# EAGLE schematic psg-4ch-mux-simple (EAGLE 6.6.0)
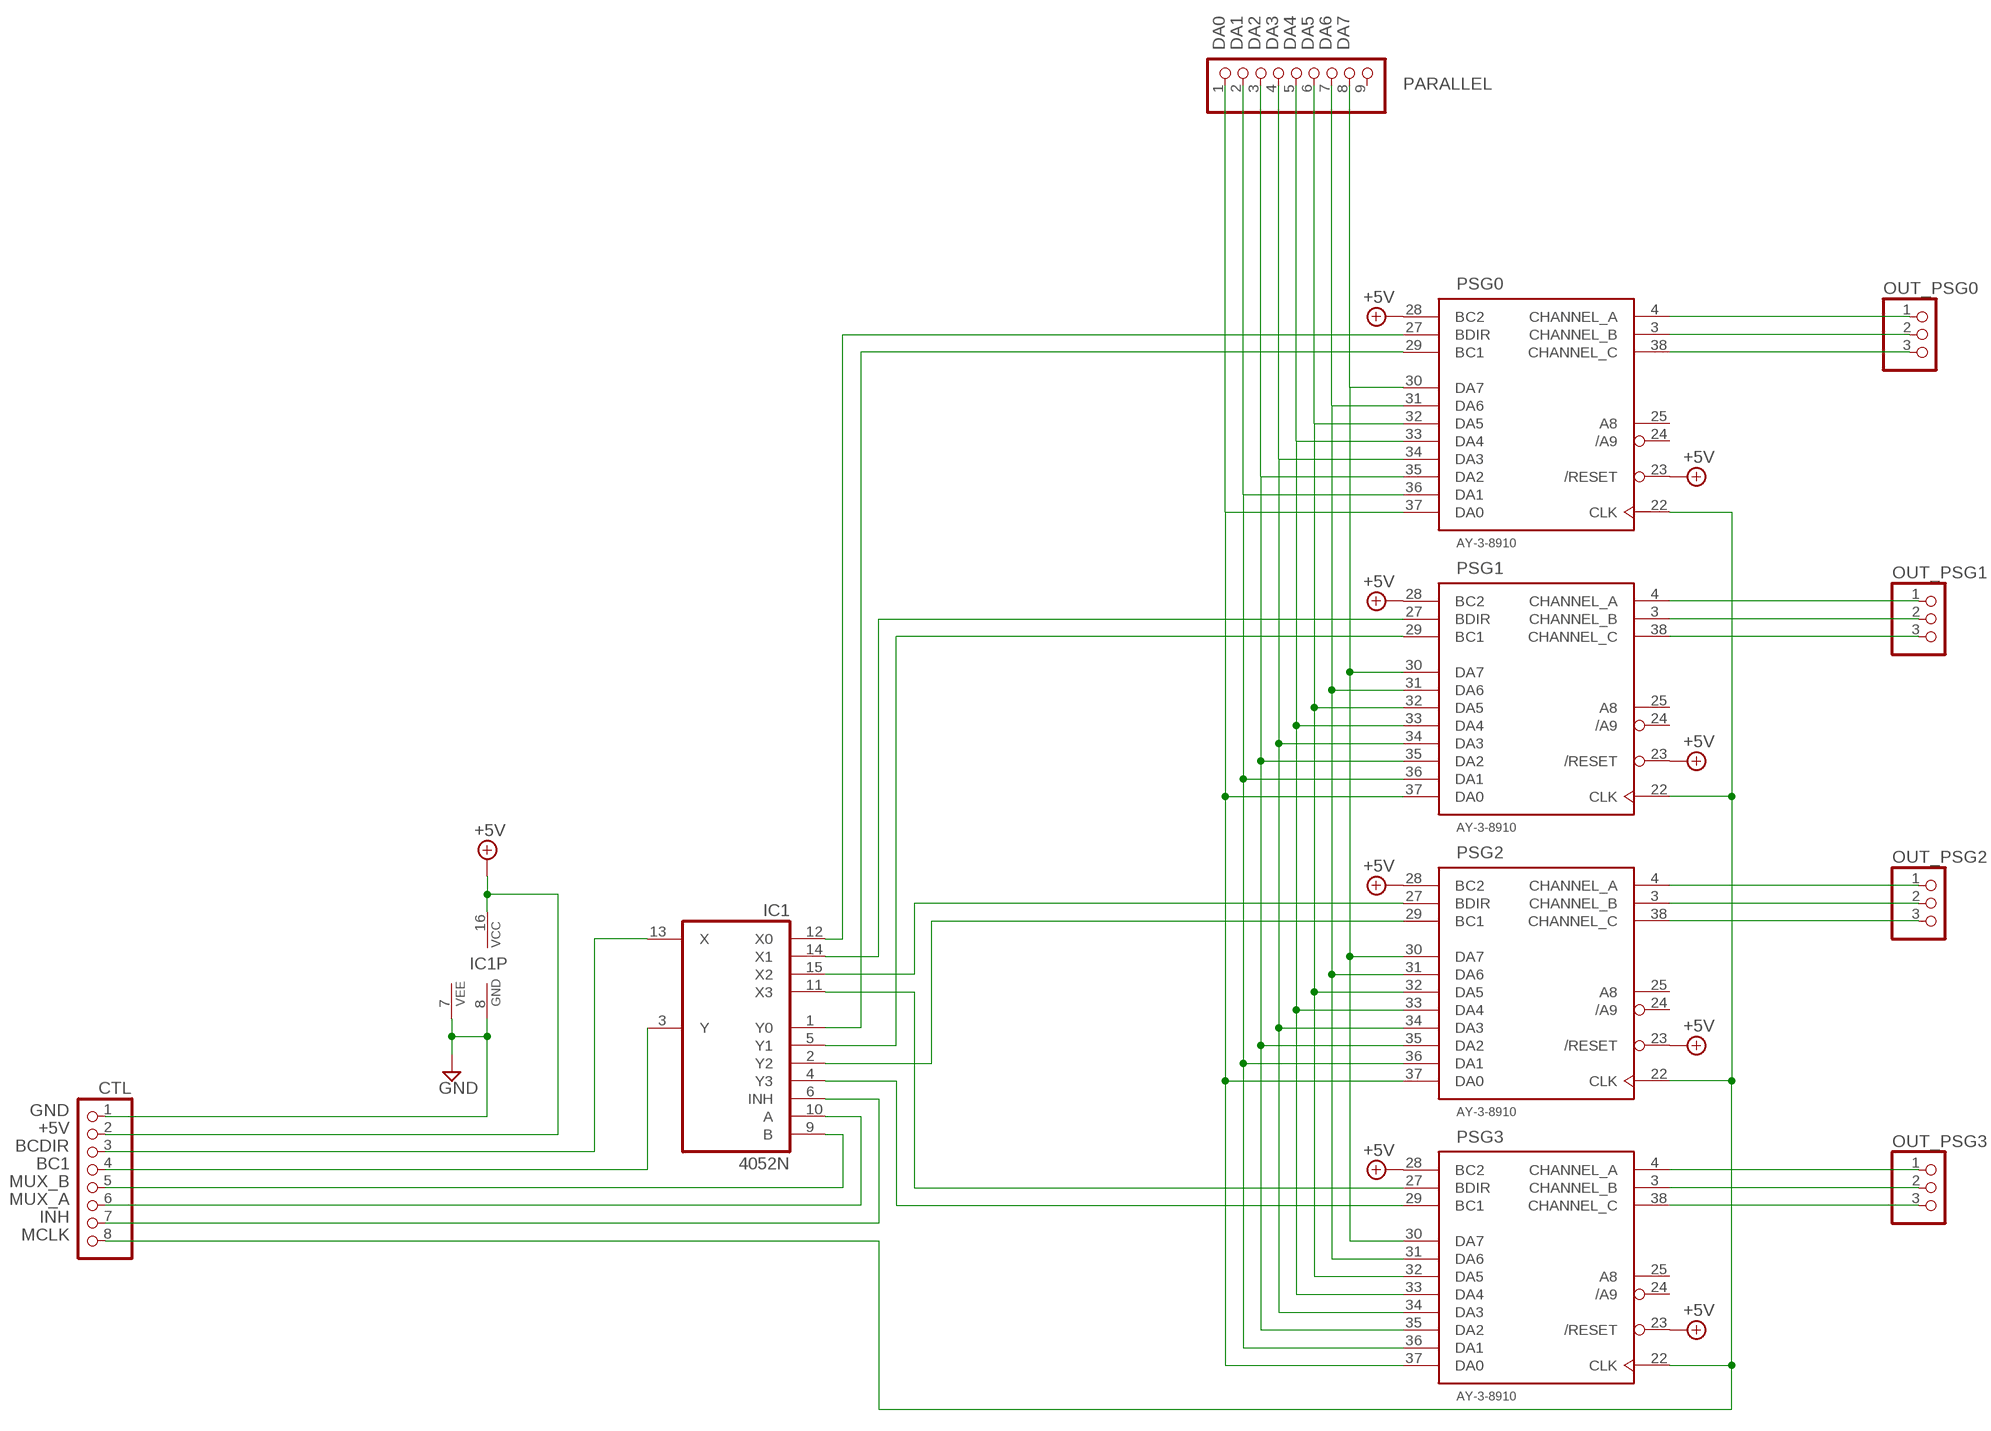
[diagram p0: schematic, sheet 1]

## Parts
CTL  PINHD-1X8  [1X08]
IC1  4052N  [DIL16]
OUT_PSG0  PINHD-1X3  [1X03]
OUT_PSG1  PINHD-1X3  [1X03]
OUT_PSG2  PINHD-1X3  [1X03]
OUT_PSG3  PINHD-1X3  [1X03]
PARALLEL  PINHD-1X9  [1X09]
PSG0  AY-3-8910(2)  [DIL-40]
PSG1  AY-3-8910(2)  [DIL-40]
PSG2  AY-3-8910(2)  [DIL-40]
PSG3  AY-3-8910(2)  [DIL-40]

## Nets
+5V: CTL.2 IC1.16(VCC) PSG0.23(/RESET) PSG0.28(BC2) PSG1.23(/RESET) PSG1.28(BC2) PSG2.23(/RESET) PSG2.28(BC2) PSG3.23(/RESET) PSG3.28(BC2)
BC1: CTL.4 IC1.3(Y)
BC1_0: IC1.1(Y0) PSG0.29(BC1)
BC1_1: IC1.5(Y1) PSG1.29(BC1)
BC1_2: IC1.2(Y2) PSG2.29(BC1)
BC1_3: IC1.4(Y3) PSG3.29(BC1)
BCDIR: CTL.3 IC1.13(X)
BCDIR_0: IC1.12(X0) PSG0.27(BDIR)
BCDIR_1: IC1.14(X1) PSG1.27(BDIR)
BCDIR_2: IC1.15(X2) PSG2.27(BDIR)
BCDIR_3: IC1.11(X3) PSG3.27(BDIR)
DA0: PARALLEL.1 PSG0.37(DA0)
DA1: PARALLEL.2 PSG0.36(DA1)
DA2: PARALLEL.3 PSG0.35(DA2)
DA3: PARALLEL.4 PSG0.34(DA3)
DA4: PARALLEL.5 PSG0.33(DA4)
DA5: PARALLEL.6 PSG0.32(DA5)
DA6: PARALLEL.7 PSG0.31(DA6)
DA7: PARALLEL.8 PSG0.30(DA7)
DA8: PSG3.37(DA0)
DA9: PSG3.36(DA1)
DA10: PSG3.35(DA2)
DA11: PSG3.34(DA3)
DA12: PSG3.33(DA4)
DA13: PSG3.32(DA5)
DA14: PSG3.31(DA6)
DA15: PSG3.30(DA7)
GND: CTL.1 IC1.7(VEE) IC1.8(GND)
INH: CTL.7 IC1.6(INH)
MCLK: CTL.8 PSG0.22(CLK) PSG1.22(CLK) PSG2.22(CLK) PSG3.22(CLK)
MUX_A: CTL.6 IC1.10(A)
MUX_B: CTL.5 IC1.9(B)
N$1: OUT_PSG0.1 PSG0.4(CHANNEL_A)
N$2: OUT_PSG0.2 PSG0.3(CHANNEL_B)
N$3: OUT_PSG0.3 PSG0.38(CHANNEL_C)
N$4: OUT_PSG1.1 PSG1.4(CHANNEL_A)
N$5: OUT_PSG1.2 PSG1.3(CHANNEL_B)
N$6: OUT_PSG1.3 PSG1.38(CHANNEL_C)
N$7: OUT_PSG2.1 PSG2.4(CHANNEL_A)
N$8: OUT_PSG2.2 PSG2.3(CHANNEL_B)
N$9: OUT_PSG2.3 PSG2.38(CHANNEL_C)
N$10: OUT_PSG3.1 PSG3.4(CHANNEL_A)
N$11: OUT_PSG3.2 PSG3.3(CHANNEL_B)
N$12: OUT_PSG3.3 PSG3.38(CHANNEL_C)
N$17: PSG1.30(DA7)
N$18: PSG1.31(DA6)
N$19: PSG1.32(DA5)
N$20: PSG1.33(DA4)
N$21: PSG1.34(DA3)
N$22: PSG1.35(DA2)
N$23: PSG1.36(DA1)
N$24: PSG1.37(DA0)
N$25: PSG2.30(DA7)
N$26: PSG2.31(DA6)
N$27: PSG2.32(DA5)
N$28: PSG2.33(DA4)
N$29: PSG2.34(DA3)
N$30: PSG2.35(DA2)
N$31: PSG2.36(DA1)
N$32: PSG2.37(DA0)
Unconnected: PARALLEL.9 PSG0.24(/A9) PSG0.25(A8) PSG1.24(/A9) PSG1.25(A8) PSG2.24(/A9) PSG2.25(A8) PSG3.24(/A9) PSG3.25(A8)

## Power pins joined to a net without a drawn wire
+V: PSG0.40(+V) PSG1.40(+V) PSG2.40(+V) PSG3.40(+V)
GND: PSG0.1(GND) PSG1.1(GND) PSG2.1(GND) PSG3.1(GND)

## Library data of the parts
CTL = pinhead:PINHD-1X8: PIN HEADER
IC1 = 40xx:4052: Dual 4-channel ANALOG MULTIPLEXER
OUT_PSG0 OUT_PSG1-OUT_PSG3 = pinhead:PINHD-1X3: PIN HEADER
PARALLEL = pinhead:PINHD-1X9: PIN HEADER
PSG0 PSG1-PSG3 = jaapie:AY-3-8910(2)